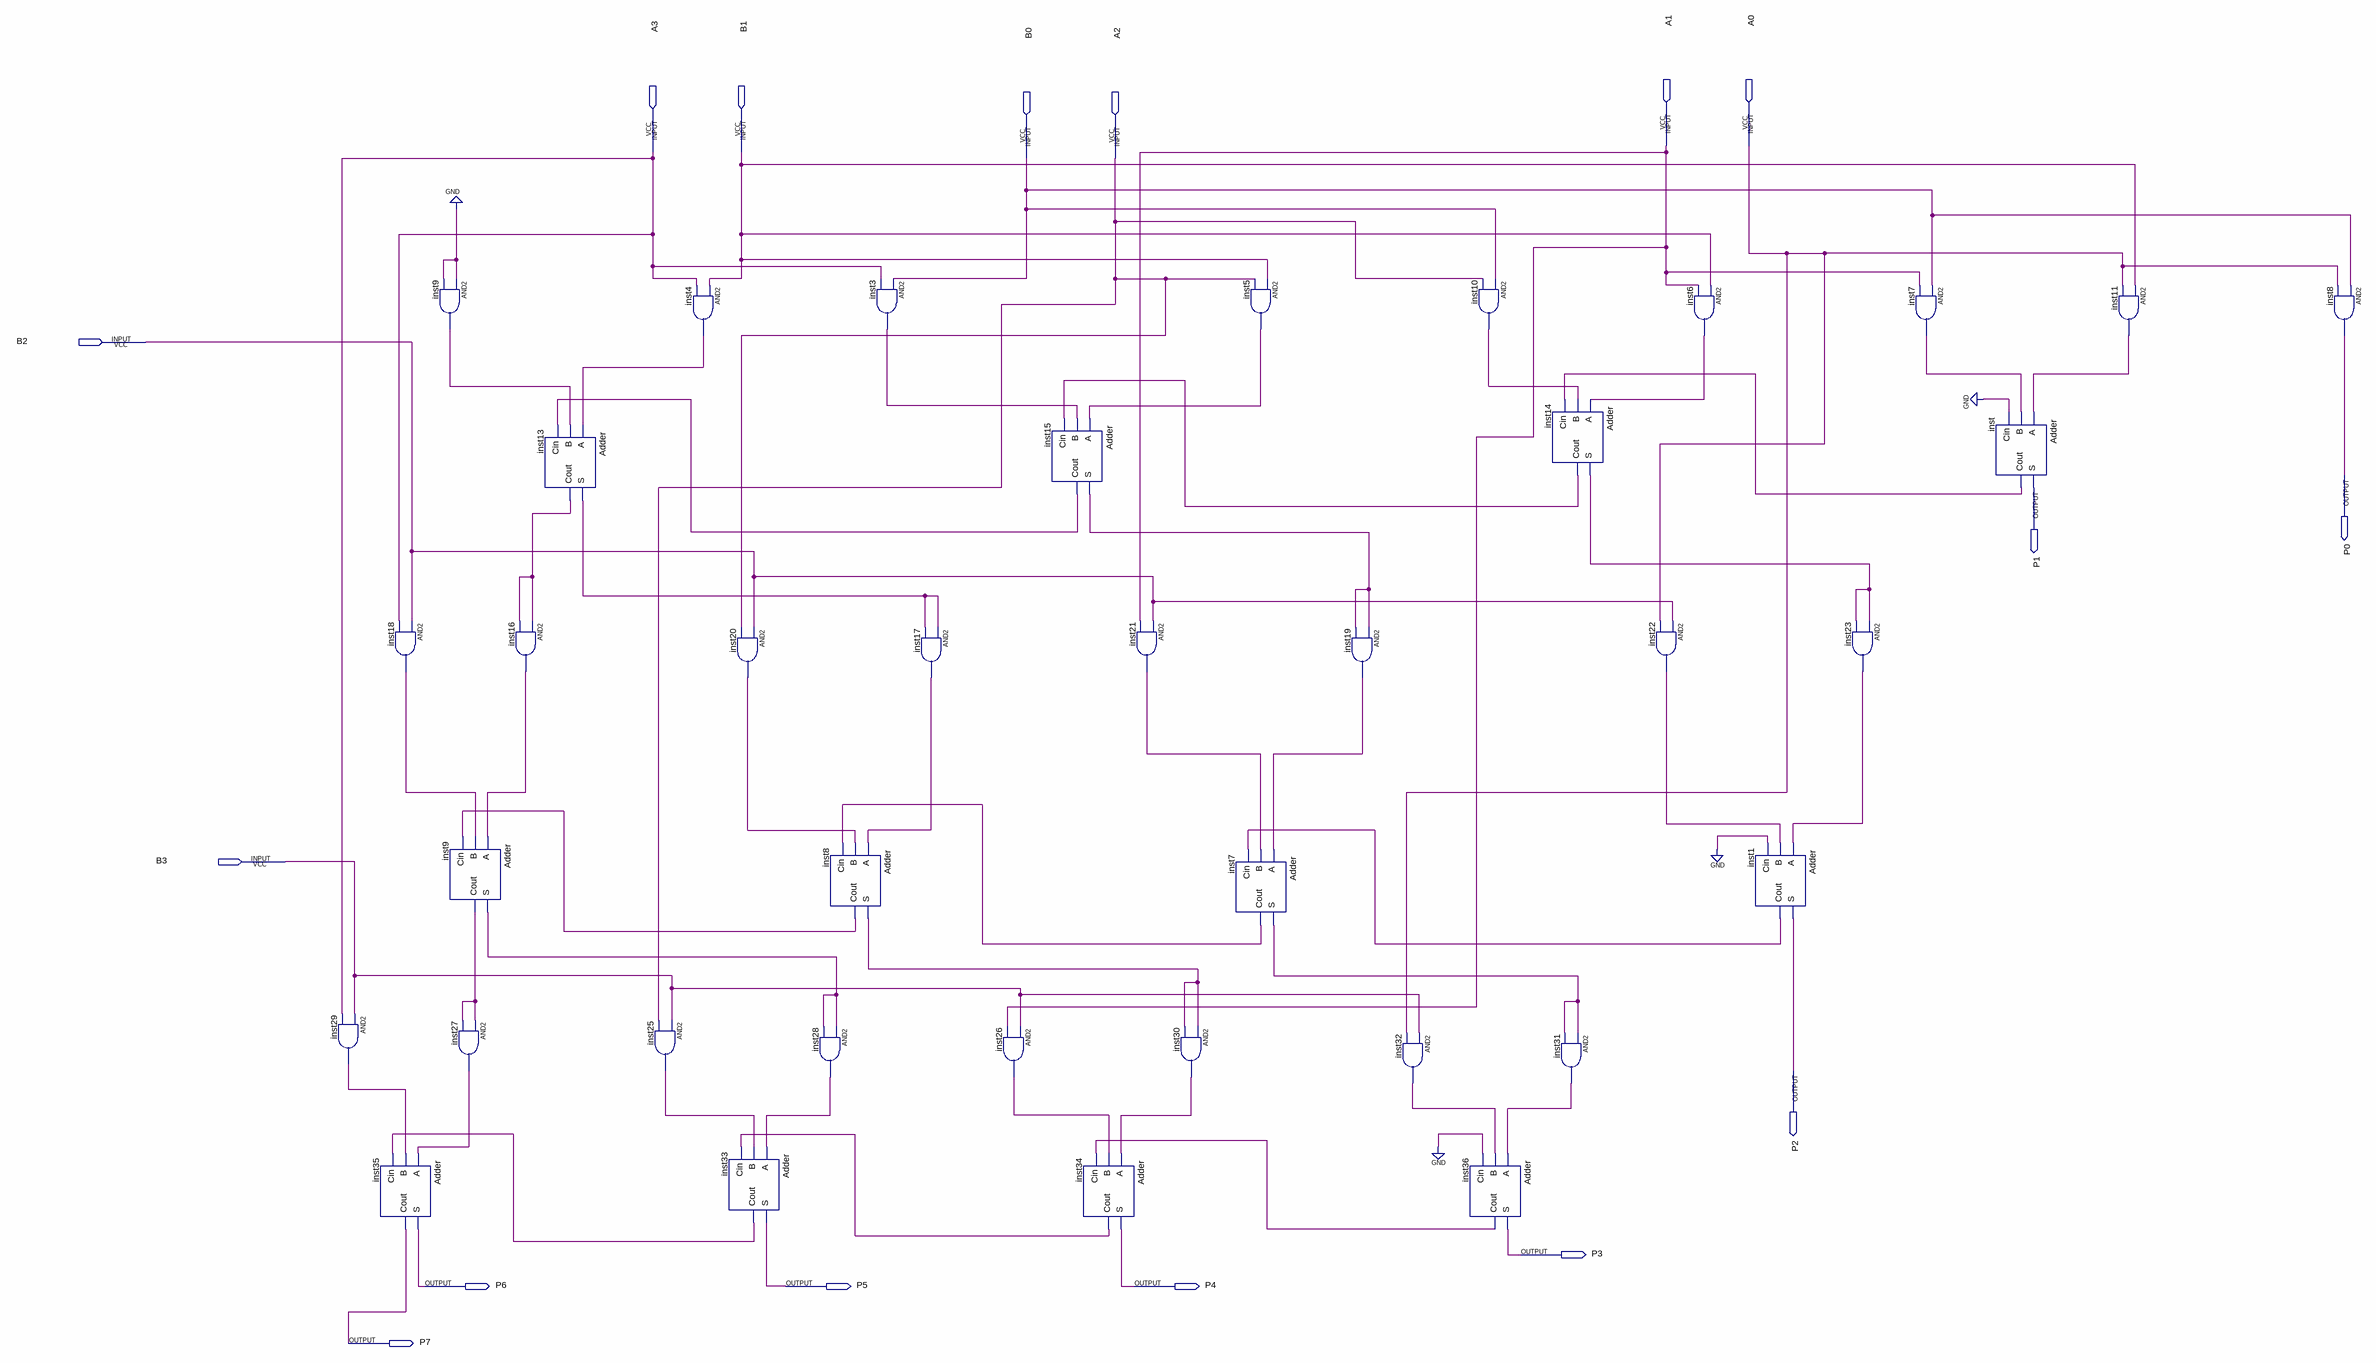
[diagram p0: schematic sheet]
// Quartus schematic Multiplyer.bdf as structural Verilog: 37 symbols, 16 pins
module Multiplyer (
  input  A1,
  input  A0,
  input  A3,
  input  B1,
  input  B0,
  input  A2,
  input  B2,
  input  B3,
  output P0,
  output P1,
  output P2,
  output P3,
  output P6,
  output P5,
  output P4,
  output P7
);

  wire inst1_cout, inst3_out, inst4_out, inst5_out, inst6_out, inst7_cout, inst7_out, inst7_s, inst8_cout,
       inst8_s, inst9_cout, inst9_out, inst9_s, inst10_out, inst11_out, inst13_cout, inst13_s, inst14_cout,
       inst14_s, inst15_cout, inst15_s, inst16_out, inst17_out, inst18_out, inst19_out, inst20_out,
       inst21_out, inst22_out, inst23_out, inst25_out, inst26_out, inst27_out, inst28_out, inst29_out,
       inst30_out, inst31_out, inst32_out, inst33_cout, inst34_cout, inst36_cout, inst_cout;

  and inst29 (inst29_out, B3, A3);
  Adder inst35 (.A(inst27_out), .B(inst29_out), .Cin(inst33_cout), .S(P6), .Cout(P7));
  and inst9 (inst9_out, 1'b0, 1'b0);
  and inst18 (inst18_out, B2, A3);
  Adder inst9_dup2 (.A(inst16_out), .B(inst18_out), .Cin(inst8_cout), .S(inst9_s), .Cout(inst9_cout));
  and inst27 (inst27_out, inst9_cout, inst9_cout);
  Adder inst13 (.A(inst4_out), .B(inst9_out), .Cin(inst15_cout), .S(inst13_s), .Cout(inst13_cout));
  and inst16 (inst16_out, inst13_cout, inst13_cout);
  and inst4 (inst4_out, B1, A3);
  and inst25 (inst25_out, B3, A2);
  and inst20 (inst20_out, B2, A2);
  Adder inst33 (.A(inst28_out), .B(inst25_out), .Cin(inst34_cout), .S(P5), .Cout(inst33_cout));
  Adder inst8 (.A(inst17_out), .B(inst20_out), .Cin(inst7_cout), .S(inst8_s), .Cout(inst8_cout));
  and inst28 (inst28_out, inst9_s, inst9_s);
  and inst3 (inst3_out, B0, A3);
  and inst17 (inst17_out, inst13_s, inst13_s);
  Adder inst15 (.A(inst5_out), .B(inst3_out), .Cin(inst14_cout), .S(inst15_s), .Cout(inst15_cout));
  and inst26 (inst26_out, B3, A1);
  Adder inst34 (.A(inst30_out), .B(inst26_out), .Cin(inst36_cout), .S(P4), .Cout(inst34_cout));
  and inst21 (inst21_out, B2, A1);
  and inst30 (inst30_out, inst8_s, inst8_s);
  and inst5 (inst5_out, B1, A2);
  Adder inst7 (.A(inst19_out), .B(inst21_out), .Cin(inst1_cout), .S(inst7_s), .Cout(inst7_cout));
  and inst19 (inst19_out, inst15_s, inst15_s);
  and inst32 (inst32_out, B3, A0);
  and inst10 (inst10_out, B0, A2);
  Adder inst36 (.A(inst31_out), .B(inst32_out), .Cin(1'b0), .S(P3), .Cout(inst36_cout));
  Adder inst14 (.A(inst6_out), .B(inst10_out), .Cin(inst_cout), .S(inst14_s), .Cout(inst14_cout));
  and inst31 (inst31_out, inst7_s, inst7_s);
  and inst22 (inst22_out, B2, A0);
  and inst6 (inst6_out, B1, A1);
  Adder inst1 (.A(inst23_out), .B(inst22_out), .Cin(1'b0), .S(P2), .Cout(inst1_cout));
  and inst23 (inst23_out, inst14_s, inst14_s);
  and inst7_dup2 (inst7_out, B0, A1);
  Adder inst (.A(inst11_out), .B(inst7_out), .Cin(1'b0), .S(P1), .Cout(inst_cout));
  and inst11 (inst11_out, B1, A0);
  and inst8_dup2 (P0, B0, A0);
endmodule
